# EasyEDA Pro project USBHUB2.0.eprj

# Schematic Schematic1
Board Name: Board1; Create Date: 2025-02-22; Page Name: P1; Project Name: USBHUB2.0; Schematic Name: Schematic1; Update Date: 2025-02-23; Company: 嘉立创EDA; Drawed: Edwin Kevin; Page Size: A4; Version: V1.0
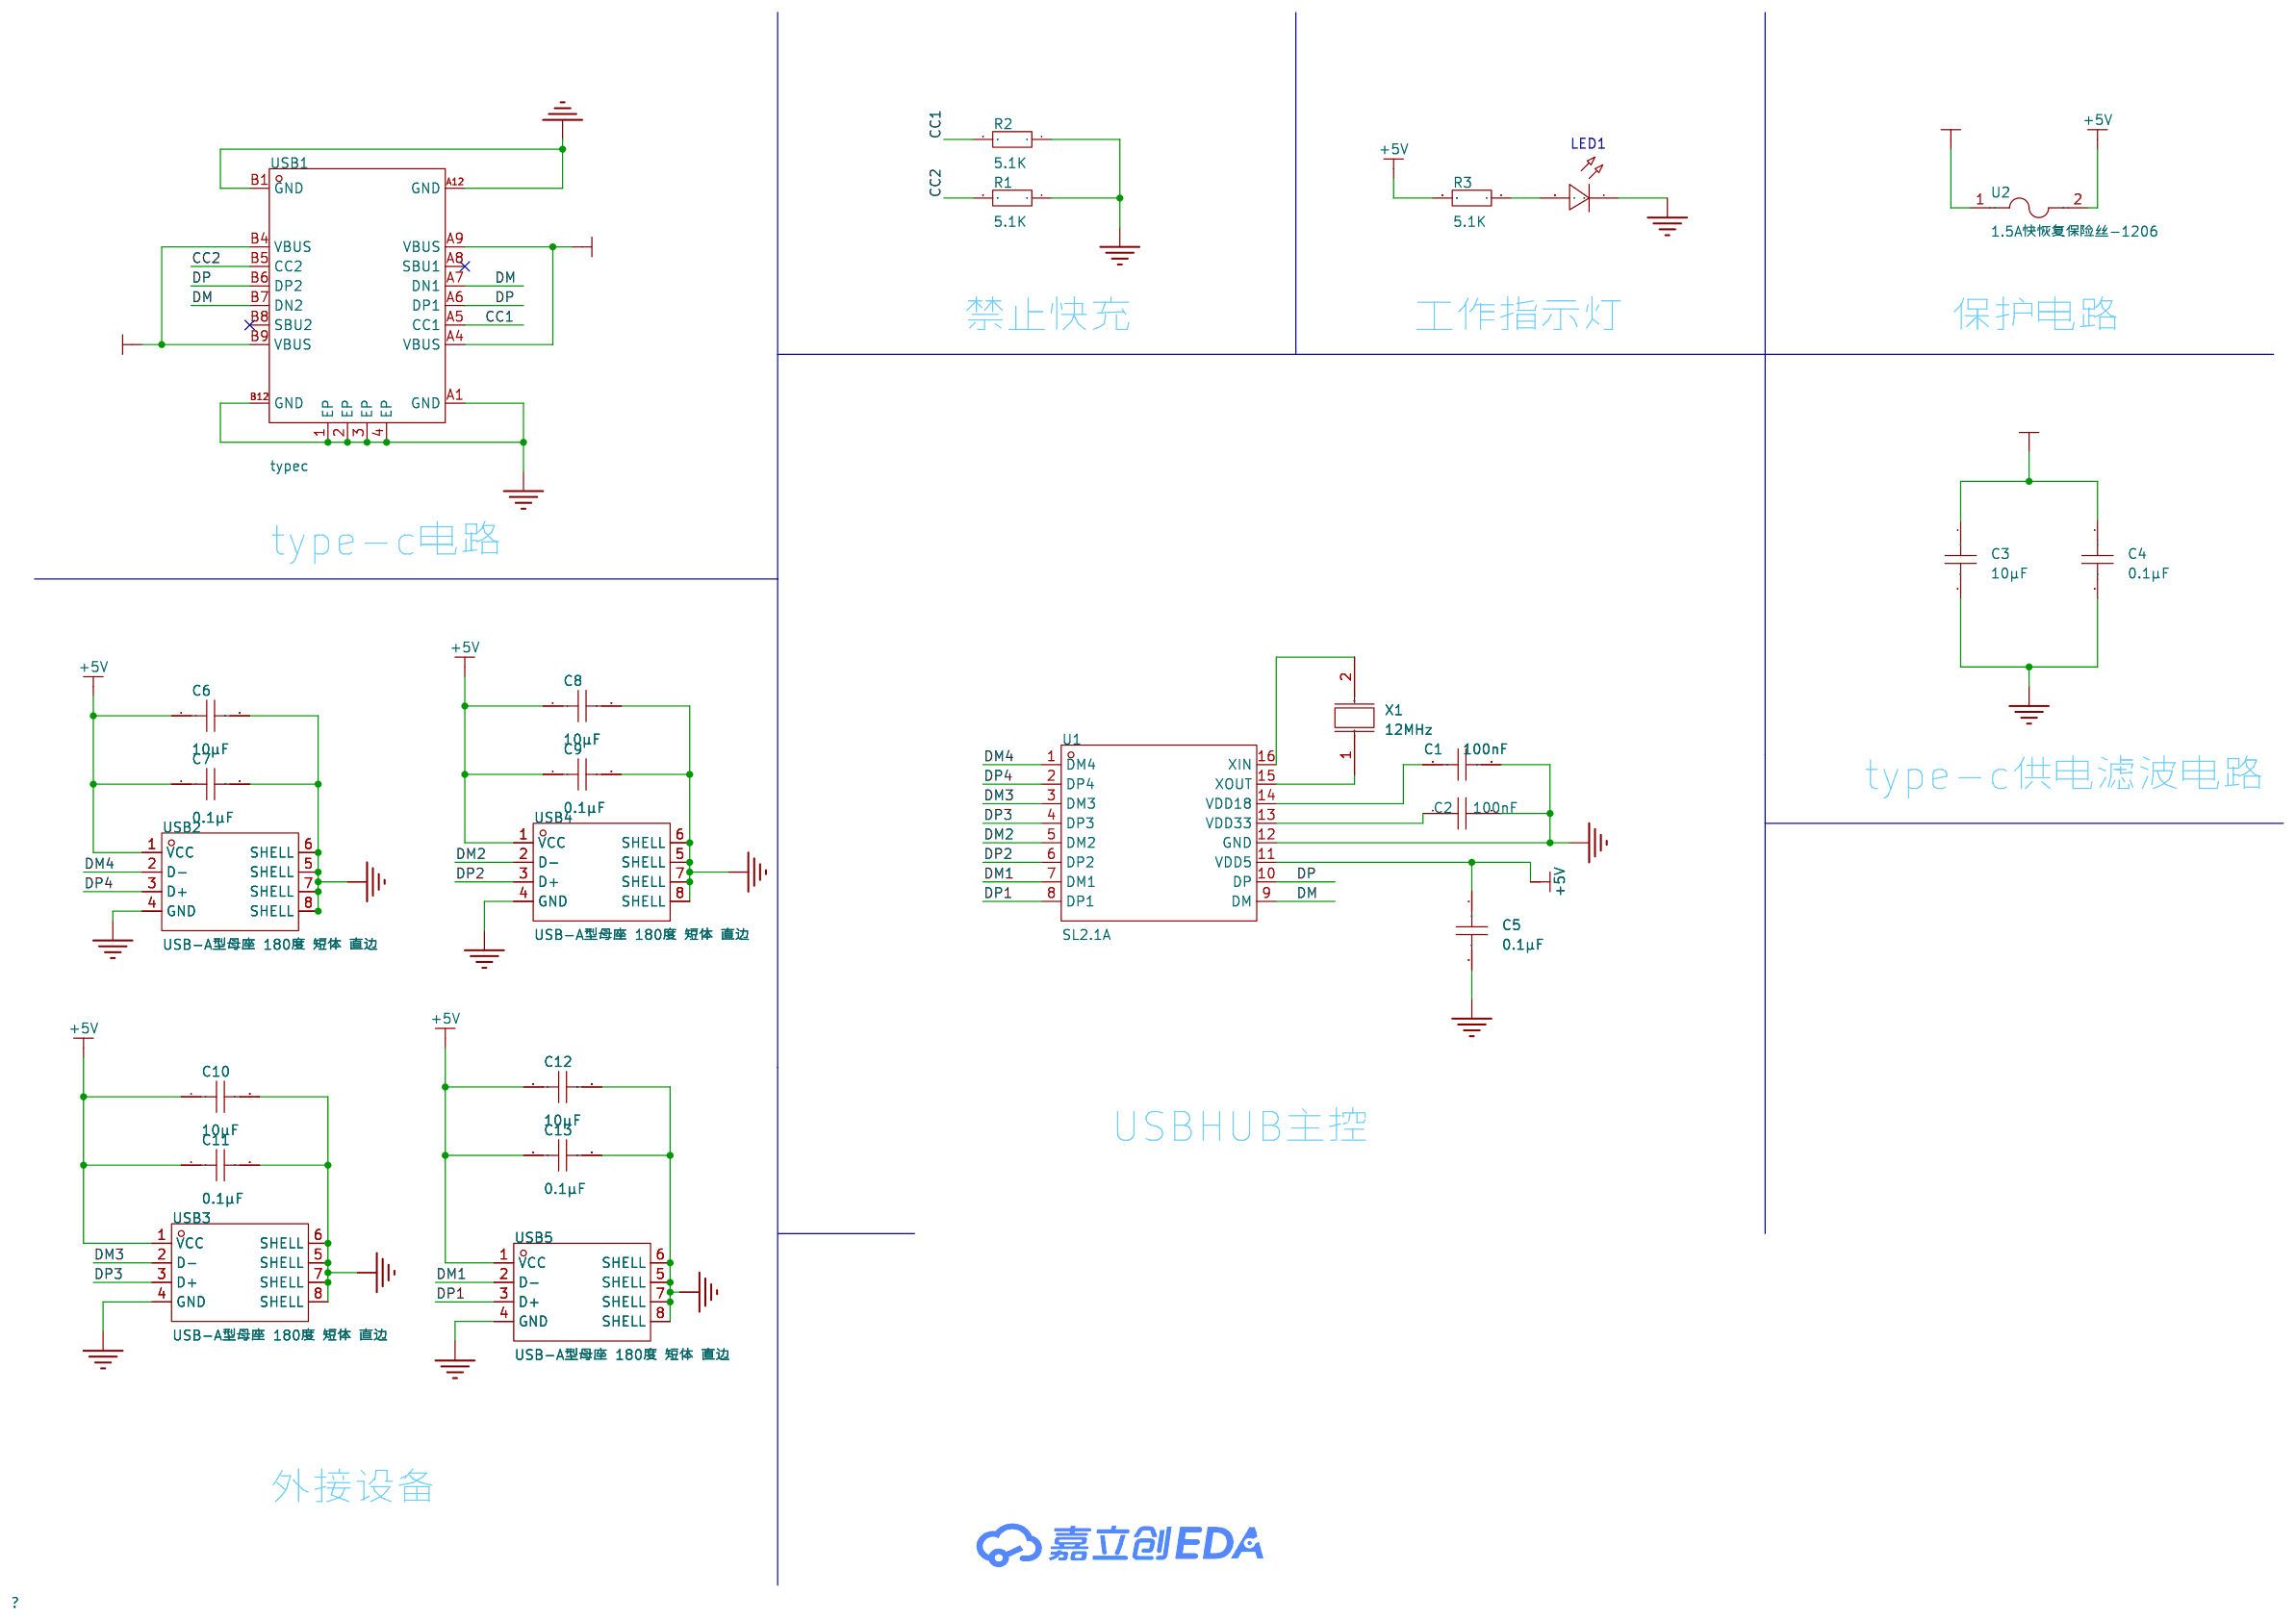
[diagram p0: schematic sheet]

## Parts
C1  100nF  [C0805]
C2  100nF  [C0805]
C3  10μF  [C0805]
C4  0.1μF  [C0805]
C5  0.1μF  [C0805]
C6  10μF  [C0805]
C7  0.1μF  [C0805]
C8  10μF  [C0805]
C9  0.1μF  [C0805]
C10  10μF  [C0805]
C11  0.1μF  [C0805]
C12  10μF  [C0805]
C13  0.1μF  [C0805]
LED1  -  [LED_0603]
R1  5.1K  [R0805]
R2  5.1K  [R0805]
R3  5.1K  [R0805]
U1  SL2.1A  [SOP-16_L10.0-W3.9-P1.27-LS6.0-BL]
U2  1.5A快恢复保险丝-1206  [F1206]
USB1  typec  [USB-C-SMD_KH-TYPE-C-16P]
USB2  USB-A型母座 180度 短体 直边  [USB-A-SMD_WT_C9900004571]
USB3  USB-A型母座 180度 短体 直边  [USB-A-SMD_WT_C9900004571]
USB4  USB-A型母座 180度 短体 直边  [USB-A-SMD_WT_C9900004571]
USB5  USB-A型母座 180度 短体 直边  [USB-A-SMD_WT_C9900004571]
X1  12MHz  [CRYSTAL-SMD_L5.0-W3.2-1-A]

## Library data of the parts
C1-C13 = CAP_0805: Supplier Footprint: 0805
LED1 = LED_0603-G: Supplier Footprint: 0603
R1-R3 = Res_0805: Supplier Footprint: 0805
U1 = SL2.1A_C6798314: Supplier Part: C6798314; Manufacturer: CoreChips(和芯润德); Supplier Footprint: SOP-16; JLCPCB Part Class: 扩展库; Datasheet: https://atta.szlcsc.com/upload/public/pdf/source/20180522/C192893_624110D24898D57AAC785E3DF98EA862.pdf; Supplier: LCSC
U2 = 1.5A快恢复保险丝-1206: Supplier Part: C9900012139; JLCPCB Part Class: 扩展库; Supplier: LCSC
USB1 = typec: Supplier Part: C9900016956; Supplier Footprint: typec 12p; JLCPCB Part Class: 扩展库; Supplier: LCSC
USB2-USB5 = USB-A型母座 180度 短体 直边: Supplier Part: C9900004571; Supplier Footprint: SMD; JLCPCB Part Class: 扩展库; Supplier: LCSC
X1 = G5312000202090: LCSC Part Name: 12MHz ±20ppm 20pF; Supplier Part: C479171; Manufacturer: JGHC(晶光华); Supplier Footprint: SMD5032; JLCPCB Part Class: 扩展库; Datasheet: https://atta.szlcsc.com/upload/public/pdf/source/20200102/C479172_02E461FA3A6D6D7CC97069C24BD4D6B6.pdf; Supplier: LCSC; Crystal Type: 贴片晶振; Normal temperature Frequency Tolerance: ±20ppm; External load capacitor: 20pF; Equivalent Series Resistance (ESR): 90Ω; Operating Temperature: -40℃~+85℃

## Nets
+5V: C5.1 C6.1 C7.1 C8.1 C9.1 C10.1 C11.1 C12.1 C13.1 R3.2 U1.11(VDD5) U2.2 USB2.1(VCC) USB3.1(VCC) USB4.1(VCC) USB5.1(VCC)
GND: C1.2 C2.2 C3.2 C4.2 C5.2 C6.2 C7.2 C8.2 C9.2 C10.2 C11.2 C12.2 C13.2 LED1.1(C) R1.1 R2.1 U1.12(GND) USB1.1(EP) USB1.2(EP) USB1.3(EP) USB1.4(EP) USB1.A1(GND) USB1.A12(GND) USB1.B1(GND) USB1.B12(GND) USB2.4(GND) USB2.5(SHELL) USB2.6(SHELL) USB2.7(SHELL) USB2.8(SHELL) USB3.4(GND) USB3.5(SHELL) USB3.6(SHELL) USB3.7(SHELL) USB3.8(SHELL) USB4.4(GND) USB4.5(SHELL) USB4.6(SHELL) USB4.7(SHELL) USB4.8(SHELL) USB5.4(GND) USB5.5(SHELL) USB5.6(SHELL) USB5.7(SHELL) USB5.8(SHELL)
VCC+5V: C3.1 C4.1 U2.1 USB1.A4(VBUS) USB1.A9(VBUS) USB1.B4(VBUS) USB1.B9(VBUS)
CC1: R2.2 USB1.A5(CC1)
CC2: R1.2 USB1.B5(CC2)
DM: U1.9(DM) USB1.A7(DN1) USB1.B7(DN2)
DM1: U1.7(DM1) USB5.2(D-)
DM2: U1.5(DM2) USB4.2(D-)
DM3: U1.3(DM3) USB3.2(D-)
DM4: U1.1(DM4) USB2.2(D-)
DP: U1.10(DP) USB1.A6(DP1) USB1.B6(DP2)
DP1: U1.8(DP1) USB5.3(D+)
DP2: U1.6(DP2) USB4.3(D+)
DP3: U1.4(DP3) USB3.3(D+)
DP4: U1.2(DP4) USB2.3(D+)
$1N830: C2.1 U1.13(VDD33)
$1N835: C1.1 U1.14(VDD18)
$1N940: U1.16(XIN) X1.2
$1N945: U1.15(XOUT) X1.1
$1N2678: LED1.2(A) R3.1

Not connected (* = marked no-connect by the designer): USB1 A8(SBU1)* B8(SBU2)*

## Notes on the sheet
- 禁止快充
- 工作指示灯
- 保护电路
- type-c电路
- type-c供电滤波电路
- USBHUB主控
- 外接设备

# Board PCB1
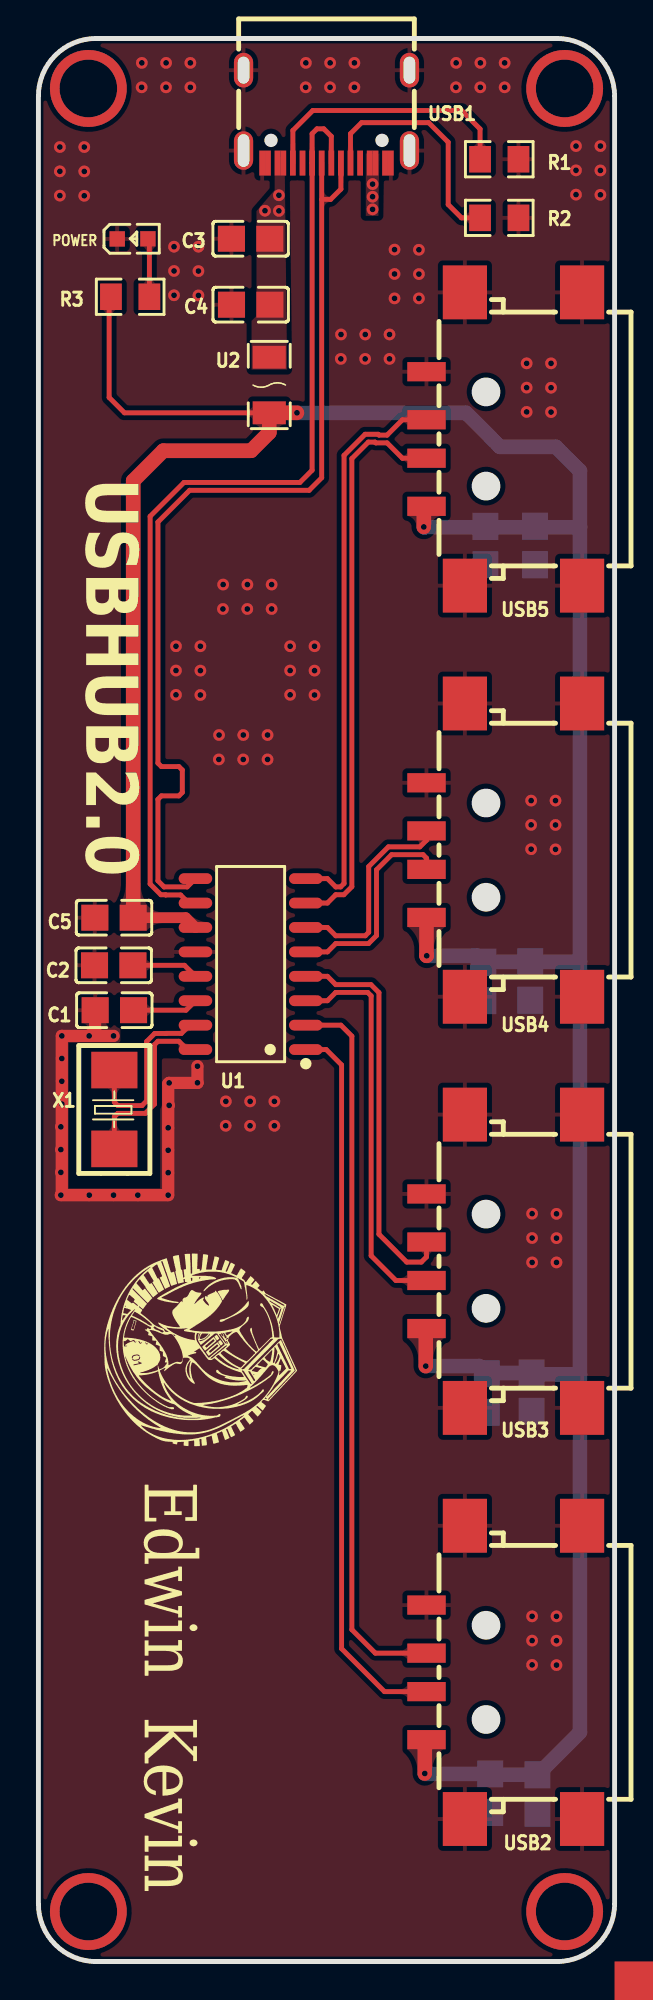
[diagram p1: board, top side]
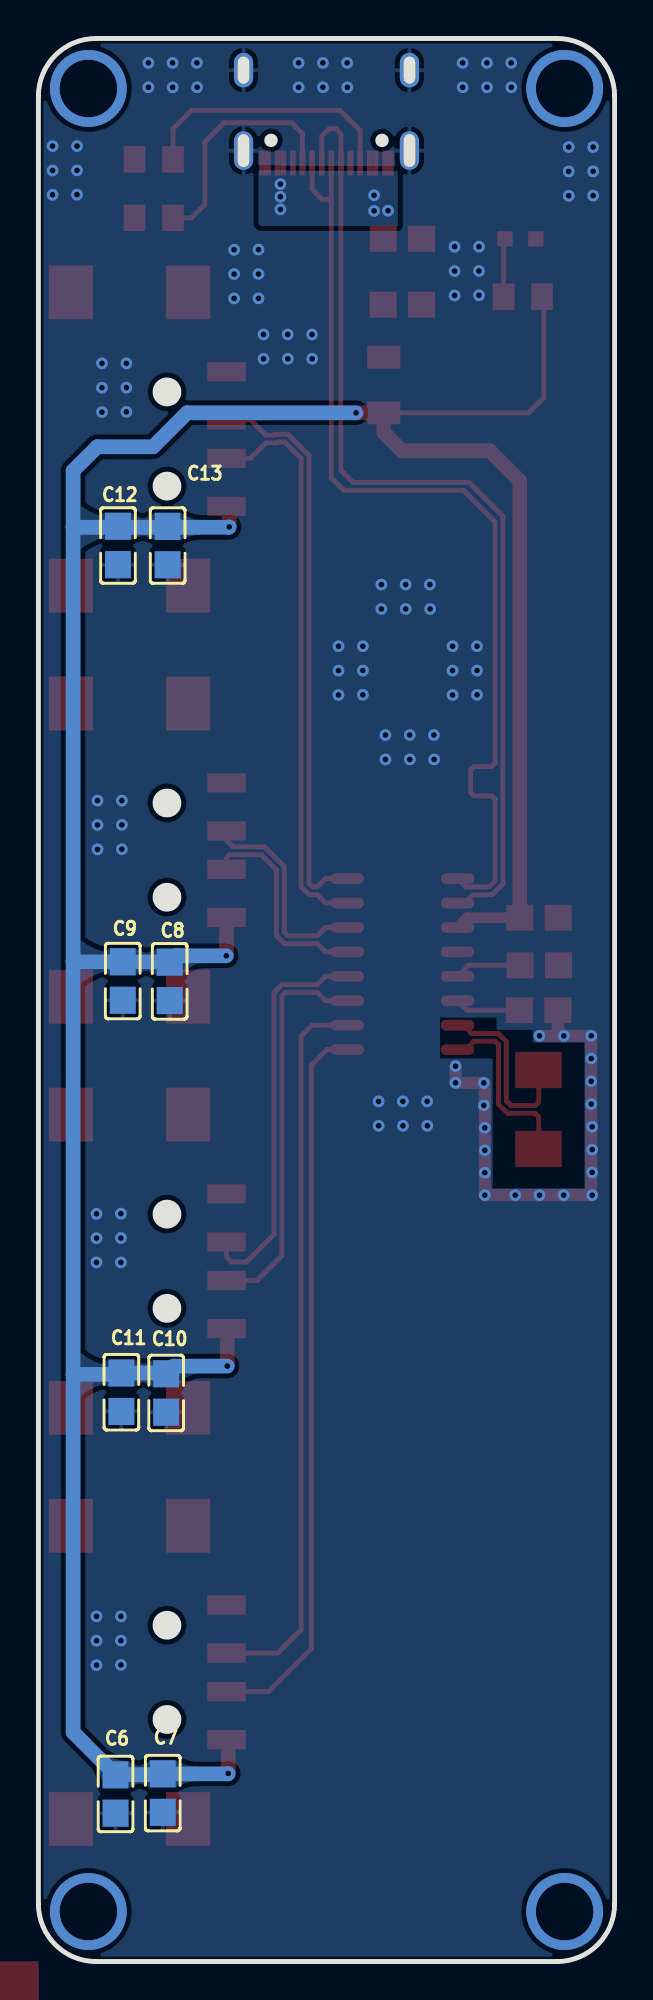
[diagram p2: board, bottom side, seen from below]

Outline 30 x 100 mm; copper layers: Top Layer, Bottom Layer. Coordinates in mm from the lower left corner of the outline.
Outline path: 0,97 0,3 arc(0.88,0.88) 3,0 27,0 arc(29.12,0.88) 30,3 30,97 arc(29.12,99.12) 27,100 3,100 arc(0.88,99.12) 0,97
Stack: Top Layer 0.035mm / Dielectric1 1.51mm FR4 er 4.5 / Bottom Layer 0.035mm

## Design rules (mm)
net DM4: DP4
net DP4: DP4
net DM3: DP3
net DP3: DP3
net DM2: DP2
net DP2: DP2
net DM1: DP1
net DP1: DP1
net $1N940: DP6
net $1N945: DP6
net DP: DP5
net DM: DP5
template: 自定义配置
spacing copperThickness1oz (default): track to track 0.102, other pairs 0.102 to 0.3
spacing copperThickness2oz: track to track 0.203, other pairs 0.152 to 0.3
track width copperThickness1oz (default): min 0.127, default 0.254, max 2.54
track width copperThickness2oz: min 0.203, default 0.254, max 2.54
differential pair differentialPair (default): width min 0.127, default 0.254, max 2.54; gap min 0.152, default 0.152
via viaSize (default): diameter min 0.5, default 0.61, max 10; hole min 0.3, default 0.305, max 6.299

## Placement (name value [footprint] x y rotation side)
C1  100nF  [C0805]  3.95 49.47 180 top
C2  100nF  [C0805]  3.92 51.8 180 top
C3  10μF  [C0805]  11.05 89.59 180 top
C4  0.1μF  [C0805]  11.05 86.16 180 top
C5  0.1μF  [C0805]  3.94 54.28 180 top
C6  10μF  [C0805]  25.98 8.71 270 bottom
C7  0.1μF  [C0805]  23.53 8.76 270 bottom
C8  10μF  [C0805]  23.16 50.97 270 bottom
C9  0.1μF  [C0805]  25.61 50.99 270 bottom
C10  10μF  [C0805]  23.35 29.57 270 bottom
C11  0.1μF  [C0805]  25.68 29.6 270 bottom
C12  10μF  [C0805]  25.86 73.64 270 bottom
C13  0.1μF  [C0805]  23.27 73.63 270 bottom
LED1  -  [LED_0603]  4.95 89.59 0 top
R1  5.1K  [R0805]  24 93.72 180 top
R2  5.1K  [R0805]  24 90.67 180 top
R3  5.1K  [R0805]  4.78 86.57 180 top
U1  SL2.1A  [SOP-16_L10.0-W3.9-P1.27-LS6.0-BL]  11.05 51.87 90 top
U2  1.5A快恢复保险丝-1206  [F1206]  12.02 81.98 270 top
USB1  typec  [USB-C-SMD_KH-TYPE-C-16P]  15 95.94 180 top
USB2  USB-A型母座 180度 短体 直边  [USB-A-SMD_WT_C9900004571]  24.26 15.04 90 top
USB3  USB-A型母座 180度 短体 直边  [USB-A-SMD_WT_C9900004571]  24.26 36.42 90 top
USB4  USB-A型母座 180度 短体 直边  [USB-A-SMD_WT_C9900004571]  24.26 57.79 90 top
USB5  USB-A型母座 180度 短体 直边  [USB-A-SMD_WT_C9900004571]  24.26 79.17 90 top
X1  12MHz  [CRYSTAL-SMD_L5.0-W3.2-1-A]  3.95 44.31 270 top

## Footprints (pads in the part's own frame, mm; a bottom-side part is the same pattern mirrored in y, then rotated)
C0805
  rect 1.41x1.35 smd: 1(-1,0) 2(1,0)
CRYSTAL-SMD_L5.0-W3.2-1-A
  rect 1.9x2.4 smd: 1(-2.05,0) 2(2.05,0)
F1206
  rect 1.19x1.728 smd: 1(-1.445,0) 2(1.445,0)
LED_0603
  rect 0.8x0.8 smd: 1(-0.851,-0.01) 2(0.75,-0.005)
R0805
  rect 1.133x1.377 smd: 1(-1,0) 2(1,0)
SOP-16_L10.0-W3.9-P1.27-LS6.0-BL
  oval 0.56x1.745 smd: 1(-4.445,-2.873) 2(-3.175,-2.873) 3(-1.905,-2.873) 4(-0.635,-2.873) 5(0.635,-2.873) 6(1.905,-2.873) 7(3.175,-2.873) 8(4.445,-2.873) 9(4.445,2.873) 10(3.175,2.873) 11(1.905,2.873) 12(0.635,2.873) 13(-0.635,2.873) 14(-1.905,2.873) 15(-3.175,2.873) 16(-4.445,2.873)
USB-A-SMD_WT_C9900004571
  rect 1x2 smd: 1(-3.5,4.05) 2(-1,4.05) 3(1,4.05) 4(3.5,4.05)
  rect 2.8x2.3 smd: 5(-7.625,2.05) 6(-7.625,-4.05) 7(7.625,-4.05) 8(7.625,2.05)
USB-C-SMD_KH-TYPE-C-16P
  oval 1x2 hole 0.6x1.7: 1(-4.32,1.765) 2(4.32,1.765)
  oval 1x1.8 hole 0.6x1.4: 3(-4.32,-2.415) 4(4.32,-2.415)
  rect 0.3x1.3 smd: A1(-3.35,2.415) A4(-2.55,2.415) A5(-1.25,2.415) A6(-0.25,2.415) A7(0.25,2.415) A8(1.25,2.415) A9(2.55,2.415) A12(3.35,2.415) B1(3.05,2.415) B4(2.25,2.415) B5(1.75,2.415) B6(0.75,2.415) B7(-0.75,2.415) B8(-1.75,2.415) B9(-2.25,2.415) B12(-3.05,2.415)

## Nets
As in the schematic.

Pads without a net: USB1 A8 B8

## Via types
v1: diameter 4, hole 3, Top Layer to Bottom Layer, 4 vias
v2: diameter 0.61, hole 0.305, Top Layer to Bottom Layer, 134 vias

## Routing (per net, layer and track width the routed paths; a pad name or vN(x,y) marks a point on that pad's centre or on a via; arc(x,y) is an arc through that point)
+5V: length 172.7
  Top Layer w0.254: R3.2 3.68,86.47 3.68,81.33 4.48,80.53 U2.2
  Top Layer w0.559: U1.11 7.67,54.28 C5.1
  Top Layer w0.762: v2(20.07,74.6) 20.07,75.53 USB5.1 ; USB4.1 20.21,52.31 v2(20.22,52.3) ; v2(20.12,9.78) 20.12,11.45 USB2.1 ; USB3.1 20.17,32.88 v2(20.17,30.96) ; C5.1 4.94,77 6.5,78.56 11.07,78.56 12.02,79.51 U2.2 v2(13.46,80.53)
  Bottom Layer w0.762: v2(20.17,30.96) 22.95,30.96 C10.1 23.39,30.6 C11.1 25.75,30.53 28.19,30.53 ; 28.19,52 28.19,30.53 ; 28.19,52 28.19,74.58 ; 28.19,52 28.18,51.99 C9.1 23.18,51.99 C8.1 22.84,52.3 v2(20.22,52.3) ; 28.19,30.53 28.19,11.92 C6.1 23.57,9.71 C7.1 20.14,9.76 v2(20.12,9.78) ; 28.19,74.58 28.19,77.52 26.94,78.77 24.03,78.77 22.26,80.53 v2(13.46,80.53) ; 28.19,74.58 28.19,74.58 20.09,74.58 v2(20.07,74.6)
GND: length 26.2
  Top Layer w0.635: v2(2.64,48.13) v2(1.22,48.13) v2(1.22,46.96) v2(1.22,45.77) v2(1.22,44.59) 1.22,39.9 v2(1.17,39.85) v2(2.65,39.85) v2(3.91,39.85) v2(5.17,39.85) v2(6.76,39.85) v2(6.76,41.02) v2(6.76,42.19) v2(6.76,43.35) 6.76,45.64 v2(6.81,45.69) 8.27,45.69 v2(8.28,45.69) v2(8.28,46.56) ; v2(2.64,48.13) 2.95,48.44 C1.2 ; v2(2.64,48.13) v2(3.91,48.13)
  vias: v2(1.12,94.35) v2(1.12,93.09) v2(1.12,91.83) v2(1.17,43.41) v2(1.17,42.22) v2(1.17,41.04) v2(2.39,94.35) v2(2.39,93.09) v2(2.39,91.82) v2(5.38,98.73) v2(5.38,97.46) v2(6.65,98.73) v2(6.64,97.46) v2(6.81,44.52) v2(7.06,89.17) v2(7.06,87.91) v2(7.06,86.65) v2(7.16,68.4) v2(7.16,67.13) v2(7.16,65.87) v2(7.91,98.73) v2(7.91,97.46) v2(8.33,89.17) v2(8.33,87.91) v2(8.33,86.64) v2(8.43,68.4) v2(8.43,67.13) v2(8.43,65.86) v2(9.41,63.78) v2(9.4,62.51) v2(9.62,71.6) v2(9.61,70.33) v2(9.76,44.73) v2(9.75,43.46) v2(10.67,63.78) v2(10.66,62.51) v2(10.88,71.6) v2(10.88,70.33) v2(11.02,44.73) v2(11.02,43.46) v2(11.93,63.78) v2(11.93,62.51) v2(12.14,71.6) v2(12.14,70.33) v2(12.29,44.73) v2(12.29,43.46) v2(13.11,68.4) v2(13.11,67.13) v2(13.11,65.87) v2(13.93,98.73) v2(13.92,97.46) v2(14.38,68.4) v2(14.38,67.13) v2(14.38,65.86) v2(15.19,98.73) v2(15.18,97.46) v2(15.75,83.34) v2(15.75,84.61) v2(16.45,98.73) v2(16.45,97.46) v2(17.02,84.61) v2(17.01,83.34) v2(18.28,84.61) v2(18.28,83.34) v2(18.54,89.02) v2(18.54,87.75) v2(18.54,86.48) v2(19.81,89.01) v2(19.81,87.75) v2(19.81,86.48) v2(21.75,98.73) v2(21.74,97.46) v2(23.01,98.73) v2(23.01,97.46) v2(24.28,98.73) v2(24.28,97.46) v2(25.42,83.11) v2(25.42,81.84) v2(25.42,80.58) v2(25.65,60.37) v2(25.65,59.11) v2(25.65,57.84) v2(25.71,38.89) v2(25.71,37.62) v2(25.71,36.35) v2(25.71,17.95) v2(25.71,16.69) v2(25.71,15.43) v2(26.69,83.11) v2(26.69,81.84) v2(26.69,80.57) v2(26.92,60.37) v2(26.92,59.1) v2(26.92,57.83) v2(26.97,38.88) v2(26.97,37.62) v2(26.97,36.35) v2(26.97,17.95) v2(26.97,16.68) v2(26.97,15.42) v2(27.99,94.41) v2(27.99,93.14) v2(27.99,91.88) v2(29.26,94.41) v2(29.26,93.14) v2(29.26,91.87)
VCC+5V:
  vias: v2(11.8,91.04) v2(12.52,91.85) v2(12.52,91.03) v2(17.4,92.43) v2(17.4,91.77) v2(17.4,91.11)
(no net):
  vias: v1(2.6,97.4) v1(2.6,2.6) v1(27.4,97.4) v1(27.4,2.6)
CC1: length 12.5
  Top Layer w0.254: USB1.A5 16.25,95.05 16.82,95.62 20.32,95.62 21.34,94.61 21.34,91.36 22.03,90.67 R2.2
CC2: length 13.8
  Top Layer w0.254: R1.2 23,95.29 22.03,96.25 14.29,96.25 13.25,95.22 USB1.B5
DM: length 51.5
  Top Layer w0.254: 14.75,91.63 14.75,77.16 14.1,76.5 7.87,76.5 6.22,74.85 6.22,62.32 6.4,62.14 7.31,62.14 7.49,61.96 7.49,60.79 7.31,60.61 6.4,60.61 6.22,60.44 6.22,56.2 6.54,55.88 7.74,55.88 U1.9 ; 14.75,91.63 USB1.A7 ; 14.75,91.63 15.21,91.63 15.75,92.17 USB1.B7
DM1: length 29.6
  Top Layer w0.254: USB5.2 18.95,78.17 18.16,78.97 17.57,78.97 17.52,79.01 17.18,79.01 16.32,78.15 16.32,55.89 15.9,55.47 15.48,55.47 15.05,55.04 U1.7
DM2: length 11
  Top Layer w0.254: 20.21,56.79 20.21,57.38 20.03,57.56 18.39,57.56 17.6,56.77 17.6,53.35 17.19,52.93 15.48,52.93 15.05,52.5 U1.5
DM3: length 20.6
  Top Layer w0.254: U1.3 15.05,49.96 15.48,50.39 17.15,50.39 17.32,50.21 17.32,36.7 18.61,35.42 20.21,35.42
DM4: length 37.9
  Top Layer w0.254: USB2.2 18.02,14.04 15.79,16.27 15.79,46.62 14.99,47.42 U1.1
DP: length 51.5
  Top Layer w0.254: USB1.A6 15.25,94.91 14.86,95.3 14.5,95.3 14.25,95.05 USB1.B6 14.25,77.55 13.61,76.91 7.58,76.91 5.82,75.15 5.82,56.03 6.38,55.47 6.62,55.47 6.63,55.46 7.4,55.46 7.82,55.04 U1.10
DP1: length 29.6
  Top Layer w0.254: USB5.3 18.95,80.17 18.16,79.38 17.73,79.38 17.69,79.42 17.01,79.42 15.91,78.32 15.91,56.06 15.73,55.88 15.48,55.88 15.05,56.31 U1.8
DP2: length 11
  Top Layer w0.254: U1.6 15.05,53.77 15.48,53.34 17.02,53.34 17.2,53.52 17.2,56.94 18.22,57.96 19.86,57.96 20.21,58.31 USB4.3
DP3: length 20.7
  Top Layer w0.254: USB3.3 20.21,36.64 19.94,36.37 19.18,36.37 17.73,37.82 17.73,50.38 17.31,50.8 15.48,50.8 15.05,51.23 U1.4
DP4: length 37.9
  Top Layer w0.254: USB2.3 17.54,16.04 16.32,17.26 16.32,48.12 15.75,48.69 U1.2
$1N830: length 3.5
  Top Layer w0.254: C2.1 7.6,51.8 U1.13
$1N835: length 3.4
  Top Layer w0.254: U1.14 7.68,49.47 C1.1
$1N940: length 9.5
  Top Layer w0.254: U1.16 7.75,47.42 7.31,47.85 6.22,47.85 6.04,47.67 6.04,44.59 5.56,44.1 4.13,44.1 3.95,43.92 X1.2
$1N945: length 9.5
  Top Layer w0.254: U1.15 7.87,48.69 7.45,48.26 6.62,48.26 6.62,48.26 6.05,48.26 5.64,47.84 5.64,44.75 5.39,44.51 4.13,44.51 3.95,44.69 X1.1
$1N2678: length 3
  Top Layer w0.254: LED1.2 5.78,89.51 R3.1

## Copper pours and planes (outline as drawn; the poured copper is in the pictures)
GND on Top Layer: -6.66,102.95 39.01,102.95 39.01,-5.56 -6.66,-5.56
GND on Bottom Layer: -5.23,108.48 43.94,108.48 43.94,-5.92 -5.23,-5.92
VCC+5V on Top Layer: 11.1,93.87 12.95,93.87 12.95,82.78 11.1,82.78
VCC+5V on Top Layer: 17.05,94.02 17.75,94.02 17.75,90.78 17.05,90.78
VCC+5V on Bottom Layer: 11.28,93.14 18.54,93.14 18.54,90.25 11.28,90.25

Small or netless copper shapes (teardrops, artwork), in the pictures only: 67 on Top Layer, 19 on Bottom Layer

## Text on the board
Top Silkscreen Layer: POWER | Edwin  Kevin | USBHUB2.0
